# Altium project ProbadorManillaresCrio.PrjPcb
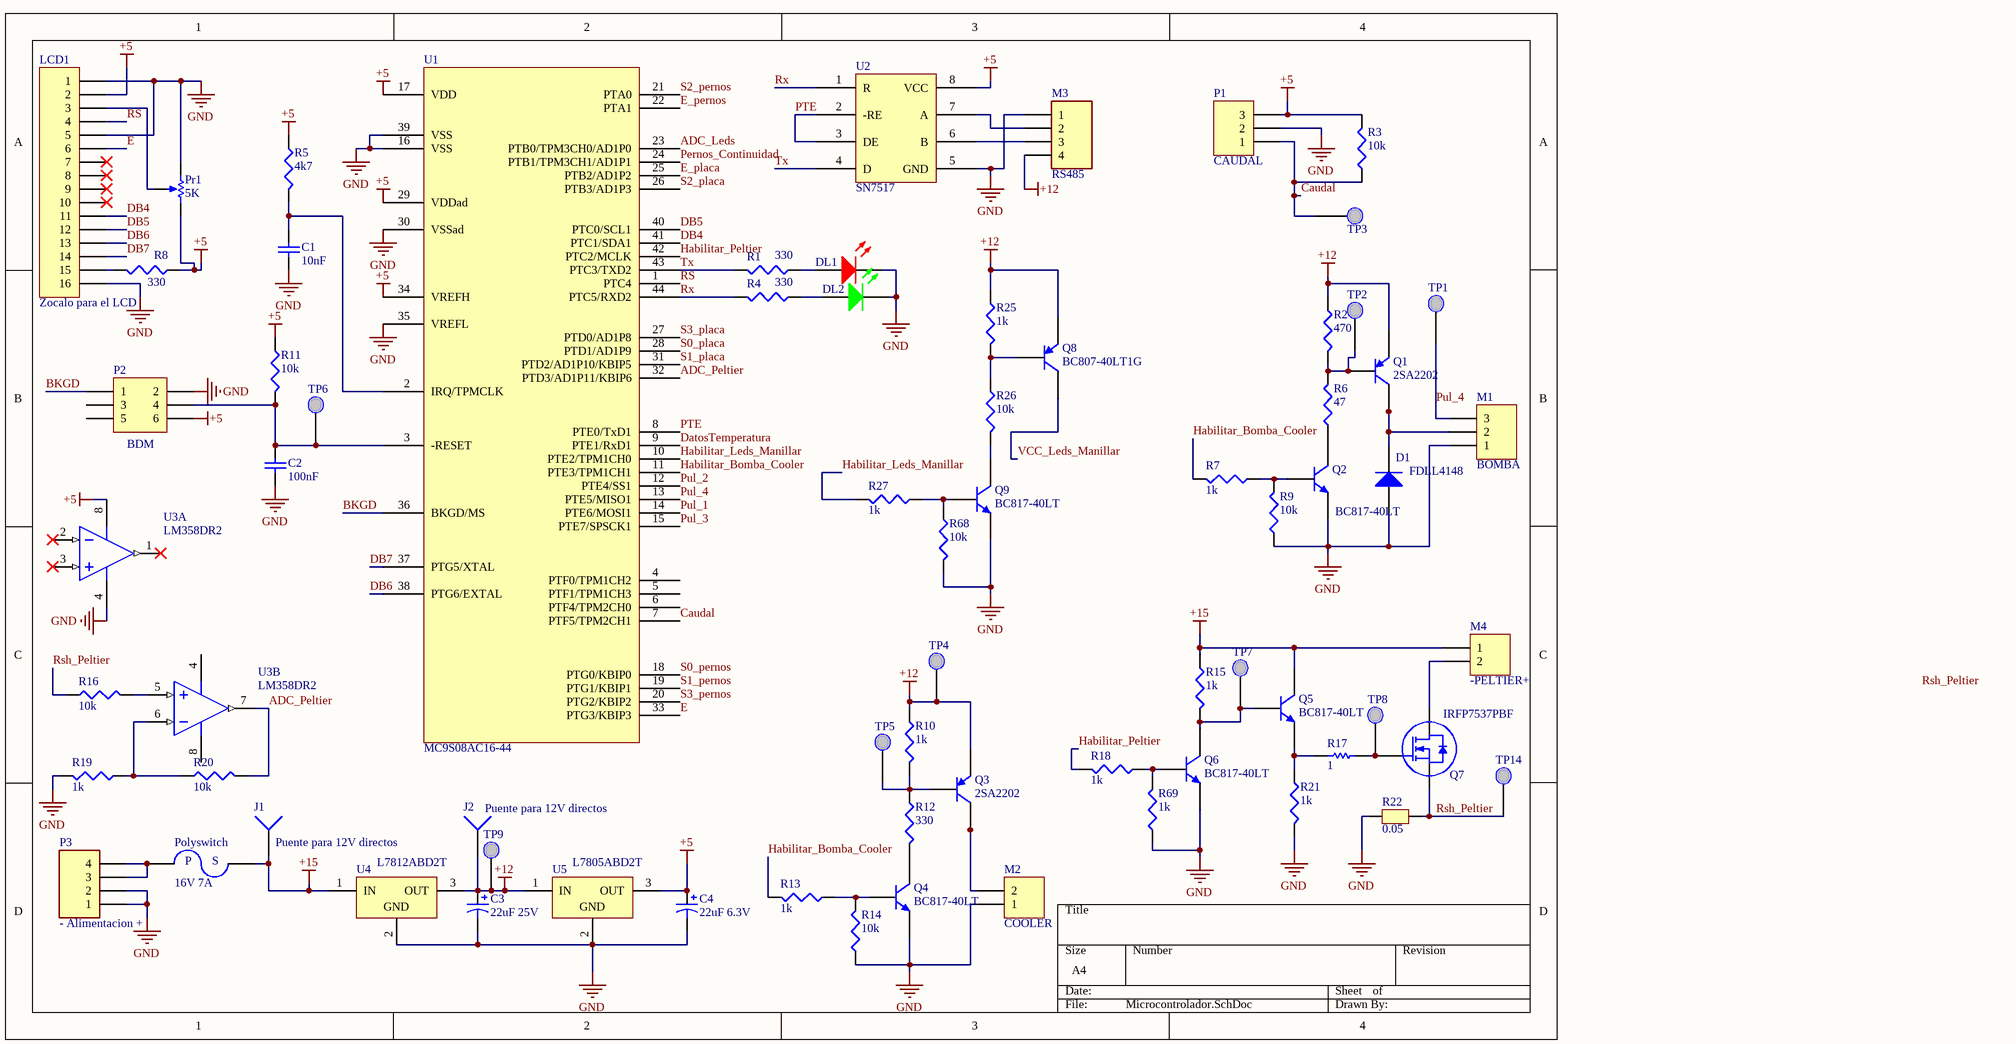
[diagram p0: Microcontrolador.SchDoc]
2 sheets, 144 parts. Net scope: global (net labels, ports and power ports of the same name join across sheets).
Board file: ProbadorManillaresCrio.PcbDoc
Sheets:
  Microcontrolador.SchDoc
  ProbadorManillaresCrio.SchDoc

## Sheet Microcontrolador.SchDoc
size A4

### Parts
C1  10nF  [6-0805_M]
C2  100nF  [6-0805_M]
C3  22uF 25V  [CAP100RP]
C4  22uF 6.3V  [CAP100RP]
D1  FDLL4148  [SOD-80/MLL34_3D]
DL1  Led3mmRojo  [LED-Rojo-3mm]  (value not drawn)
DL2  Led3mmVerde  [LED-Verde-3mm]  (value not drawn)
J1  Puente para 12V directos  [PIN1]
J2  Puente para 12V directos  [PIN1]
LCD1  Zocalo para el LCD  [LCD-20x4-Zocalo]
M1  BOMBA  [AMP100X3]
M2  COOLER  [640445-2_3D]
M3  RS485  [B4B-XH-A_3D]
M4  -PELTIER+  [640445-2_3D]
P1  CAUDAL  [B3B-XH-A_3D]
P2  BDM  [HDR2X3_3D]
P3  - Alimentacion +  [640445-4_3D]
Polyswitch  16V 7A  [Polyswitch 200mils]
Pr1  5K  [PRESET V]
Q1  2SA2202  [sot89_3D]
Q2  BC817-40LT  [SOT23_3D]
Q3  2SA2202  [sot89_3D]
Q4  BC817-40LT  [SOT23_3D]
Q5  BC817-40LT  [SOT23_3D]
Q6  BC817-40LT  [SOT23_3D]
Q7  IRFP7537PBF  [TO247]
Q8  BC807-40LT1G  [SOT23_3D]
Q9  BC817-40LT  [SOT23_3D]
R1  330  [6-0805_M]
R2  470  [6-0805_M]
R3  10k  [6-0805_M]
R4  330  [6-0805_M]
R5  4k7  [6-0805_M]
R6  47  [6-0805_M]
R7  1k  [6-0805_M]
R8  330  [6-0805_M]
R9  10k  [6-0805_M]
R10  1k  [6-0805_M]
R11  10k  [6-0805_M]
R12  330  [6-0805_M]
R13  1k  [6-0805_M]
R14  10k  [6-0805_M]
R15  1k  [6-0805_M]
R16  10k  [6-0805_M]
R17  1  [Res-Axial-0.4]
R18  1k  [6-0805_M]
R19  1k  [6-0805_M]
R20  10k  [6-0805_M]
R21  1k  [6-0805_M]
R22  0.05  [TO-220-Shunt]
R25  1k  [6-0805_M]
R26  10k  [6-0805_M]
R27  1k  [6-0805_M]
R68  10k  [6-0805_M]
R69  1k  [6-0805_M]
TP1  Test point  [TP-5002]  (value not drawn)
TP2  BaseQ1  [TP-5002]  (value not drawn)
TP3  Caudal  [TP-5002]  (value not drawn)
TP4  12v  [TP-5002]  (value not drawn)
TP5  BaseQ3  [TP-5002]  (value not drawn)
TP6  Reset  [TP-5002]  (value not drawn)
TP7  BaseQ5  [TP-5002]  (value not drawn)
TP8  GateQ7  [TP-5002]  (value not drawn)
TP9  12v  [TP-5002]  (value not drawn)
TP14  Vshunt  [TP-5002]  (value not drawn)
U1  MC9S08AC16-44  [QFP10x10-G44/Z14.4N_3D]
U2  SN7517  [751-07_N]
U3  LM358DR2  [751-07_L]  (parts A,B of 2)
U4  L7812ABD2T  [TO-263]
U5  L7805ABD2T  [TO-263]

### Nets
+5: C4.1 LCD1.2 P1.3 P2.6 Pr1.3(BOT_CW) R3.2 R5.1 R8.1 R11.1 U1.17(VDD) U1.29(VDDad) U1.34(VREFH) U2.8(VCC) U3.8(V+) U5.3(OUT)
+12: C3.1 J2.1 M3.4 Q1.3(E) Q3.3(E) Q8.2(E) R2.1 R10.1 R25.1 TP4.1 TP9.1 U4.3(OUT) U5.1(IN)
+15: J1.1 M4.1 Polyswitch.1 Q5.3(C) R15.1 U4.1(IN)
GND: C1.1 C2.1 C3.2 C4.2 D1.1(A) DL1.2(K) DL2.2(K) LCD1.1 LCD1.5 LCD1.16 M1.1 M2.1 M3.1 P1.2 P2.2 P3.1 P3.2 Pr1.1(TOP_CCW) Q2.2(E) Q4.2(E) Q6.2(E) Q9.2(E) R9.1 R14.1 R19.2 R21.2 R22.1 R68.2 R69.1 U1.16(VSS) U1.30(VSSad) U1.35(VREFL) U1.39(VSS) U2.5(GND) U3.4(V-) U4.2(GND) U5.2(GND)
ADC_Leds: U1.23(PTB0/TPM3CH0/AD1P0)
ADC_Peltier: R20.2 U1.32(PTD3/AD1P11/KBIP6) U3.7(OUT)
BKGD: P2.1 U1.36(BKGD/MS)
Caudal: P1.1 R3.1 TP3.1 U1.7(PTF5/TPM2CH1)
DatosTemperatura: U1.9(PTE1/RxD1)
DB4: LCD1.11 U1.41(PTC1/SDA1)
DB5: LCD1.12 U1.40(PTC0/SCL1)
DB6: LCD1.13 U1.38(PTG6/EXTAL)
DB7: LCD1.14 U1.37(PTG5/XTAL)
E: LCD1.6 U1.33(PTG3/KBIP3)
E_pernos: U1.22(PTA1)
E_placa: U1.25(PTB2/AD1P2)
Habilitar_Bomba_Cooler: R7.2 R13.2 U1.11(PTE3/TPM1CH1)
Habilitar_Leds_Manillar: R27.2 U1.10(PTE2/TPM1CH0)
Habilitar_Peltier: R18.2 U1.42(PTC2/MCLK)
Pernos_Continuidad: U1.24(PTB1/TPM3CH1/AD1P1)
PTE: U1.8(PTE0/TxD1) U2.2(-RE) U2.3(DE)
Pul_1: U1.14(PTE6/MOSI1)
Pul_2: U1.12(PTE4/SS1)
Pul_3: U1.15(PTE7/SPSCK1)
Pul_4: M1.3 TP1.1 U1.13(PTE5/MISO1)
RS: LCD1.4 U1.1(PTC4)
Rsh_Peltier: Q7.3(S) R16.1 R22.3 TP14.1
Rx: R4.2 U1.44(PTC5/RXD2) U2.1(R)
S0_pernos: U1.18(PTG0/KBIP0)
S0_placa: U1.28(PTD1/AD1P9)
S1_pernos: U1.19(PTG1/KBIP1)
S1_placa: U1.31(PTD2/AD1P10/KBIP5)
S2_pernos: U1.21(PTA0)
S2_placa: U1.26(PTB3/AD1P3)
S3_pernos: U1.20(PTG2/KBIP2)
S3_placa: U1.27(PTD0/AD1P8)
Tx: R1.2 U1.43(PTC3/TXD2) U2.4(D)
VCC_Leds_Manillar: Q8.3(C)
NetC1_2: C1.2 R5.2 U1.2(IRQ/TPMCLK)
NetC2_2: C2.2 P2.4 R11.2 TP6.1 U1.3(-RESET)
NetD1_2: D1.2(K) M1.2 Q1.0(C) Q1.2(C)
NetDL1_1: DL1.1(A) R1.1
NetDL2_1: DL2.1(A) R4.1
NetLCD1_3: LCD1.3 Pr1.2(TAP)
NetLCD1_15: LCD1.15 R8.2
NetM2_2: M2.2 Q3.0(C) Q3.2(C)
NetM3_2: M3.2 U2.7(A)
NetM3_3: M3.3 U2.6(B)
NetM4_2: M4.2 Q7.2(D)
NetP3_3: P3.3 P3.4 Polyswitch.2
NetQ1_1: Q1.1(B) R2.2 R6.2 TP2.1
NetQ2_1: Q2.1(B) R7.1 R9.2
NetQ2_3: Q2.3(C) R6.1
NetQ3_1: Q3.1(B) R10.2 R12.1 TP5.1
NetQ4_1: Q4.1(B) R13.1 R14.2
NetQ4_3: Q4.3(C) R12.2
NetQ5_1: Q5.1(B) Q6.3(C) R15.2 TP7.1
NetQ5_2: Q5.2(E) R17.2 R21.1
NetQ6_1: Q6.1(B) R18.1 R69.2
NetQ7_1: Q7.1(G) R17.1 TP8.1
NetQ8_1: Q8.1(B) R25.2 R26.1
NetQ9_1: Q9.1(B) R27.1 R68.1
NetQ9_3: Q9.3(C) R26.2
NetR16_2: R16.2 U3.5(IN+)
NetR19_1: R19.1 R20.1 U3.6(IN-)

Not connected (* = marked no-connect by the designer): LCD1 7* 8* 9* 10*; P2 3 5; U1 4(PTF0/TPM1CH2) 5(PTF1/TPM1CH3) 6(PTF4/TPM2CH0); U3 1(OUT)* 2(IN-)* 3(IN+)*

### Notes on the sheet
- Labels drawn without touching a wire or pin: Rsh_Peltier
- (in symbol Polyswitch) P; S

### Library data of the parts
C1 = Cap: CAP CER 10000PF 50V 10% X7R 0805; Cod.Fabricante: C0805C103K5RACTU; Fabricante: Kemet; PackageReference: 6-0805_M; PackageDescription: Radial Cap, Thru-Hole; 2 Leads; 0.3 in Pin Spacing; Value: 10nF; Cod.Digikey: 399-1158-1-ND; DIGIKEYx100: 0.06190
C2 = Cap: CAP CER 0.1UF 50V 10% X7R 0805; Cod.Fabricante: C0805C104K5RACTU; Fabricante: Kemet; PackageReference: 6-0805_M; PackageDescription: Radial Cap, Thru-Hole; 2 Leads; 0.3 in Pin Spacing; Value: 100nF; Cod.Digikey: 399-1170-1-ND; DIGIKEYx100: 0.08340
C3 = CAP_ALUM_22UF_25V: CAP ALUM 22UF 20% 25V RADIAL; Cod.Fabricante: UVR1E220MDD; Fabricante: Nichicon; Published: 8-Jun-2000; LatestRevisionDate: 17-Jul-2002; LatestRevisionNote: Re-released for DXP Platform.; Publisher: Altium Limited; PackageDescription: Radial, Can; Value: 22uF 25V; Cod.Digikey: 493-1058-ND; DIGIKEYx100: 0.08420; ComponentLink2URL: http://nichicon-us.com/english/products/pdfs/e-uvr.pdf; ComponentLink2Description: Datasheet
C4 = CAP_ALUM_22UF_6.3V: CAP ALUM 22UF 20% 6.3V RADIAL; Cod.Fabricante: UVR0J220MDD1TD; Fabricante: Nichicon; Published: 8-Jun-2000; LatestRevisionDate: 17-Jul-2002; LatestRevisionNote: Re-released for DXP Platform.; Publisher: Altium Limited; PackageDescription: Radial, Can; Value: 22uF 6.3V; Cod.Digikey: 493-12740-1-ND; DIGIKEYx100: 0.09520; ComponentLink2URL: http://nichicon-us.com/english/products/pdfs/e-uvr.pdf; ComponentLink2Description: Datasheet
D1 = Diode FDLL4148: DIODE GEN PURP 100V 200MA LL34/SOD80/MINI MELF; Fabricante: ON Semiconductor; Published: 8-Jun-2000; LatestRevisionDate: 17-Jul-2002; LatestRevisionNote: Re-released for DXP Platform.; DatasheetDocument: 1998; PackageDocument: Aug-1999; PackageReference: MINI MELF; Publisher: Altium Limited; Code_JEDEC: MINI MELF; ComponentLink1Description: Manufacturer Link; ComponentLink1URL: https://www.fairchildsemi.com; ComponentLink2Description: Datasheet; ComponentLink2URL: https://www.fairchildsemi.com/datasheets/FD/FDLL4148.pdf; Value: FDLL4148; Cod.Digikey: FDLL4148CT-ND; Cod.Fabricante: FDLL4148; DIGIKEYx100: 0.0487
DL1 = Led3mmRojo: LED RED DIFFUSED 3MM ROUND T/H; Cod.Fabricante: 151031SS04000; Fabricante: Wurth Electronics Inc.; Cod.DigiKey: 732-5005-ND; ComponentLink1Description: Manufacturer Link; ComponentLink1URL: *; ComponentLink2Description: Datasheet; ComponentLink2URL: https://katalog.we-online.de/led/datasheet/151031SS04000.pdf; DatasheetVersion: *; DIGIKEYx100: 0.14480; LatestRevisionDate: *; LatestRevisionNote: *; PackageDescription: *; PackageReference: *; PackageVersion: *; Published: 29-sep-00; Publisher: Altium Limited; Value: *
DL2 = Led3mmVerde: LED GREEN DIFFUSED 3MM ROUND T/H; Cod.Fabricante: 151031VS06000; Fabricante: Wurth Electronics Inc.; Cod.DigiKey: 732-5008-ND; ComponentLink1Description: Manufacturer Link; ComponentLink1URL: *; ComponentLink2Description: Datasheet; ComponentLink2URL: https://katalog.we-online.de/led/datasheet/151031VS06000.pdf; DatasheetVersion: *; DIGIKEYx100: 0.13070; LatestRevisionDate: *; LatestRevisionNote: *; PackageDescription: *; PackageReference: *; PackageVersion: *; Published: 29-sep-00; Publisher: Altium Limited; Value: *
J1 J2 = Socket: Value: Via simple; LatestRevisionDate: 17-Jul-2002; LatestRevisionNote: Re-released for DXP Platform.; Publisher: Altium Limited; Cod.Digikey: -; Cod.Fabricante: -; Fabricante: -
LCD1 = Header 16: LCD de 20x4; Cod.Fabricante: PPPC161LFBN-RC; Fabricante: Sullins Connector Solutions; LatestRevisionDate: 17-Jul-2002; LatestRevisionNote: Re-released for DXP Platform.; Publisher: Altium Limited; Cod.Digikey: S7049-ND; ComponentLink1Description: Datasheets; ComponentLink1URL: https://drawings-pdf.s3.amazonaws.com/10492.pdf; ComponentLink2Description: Datasheets; ComponentLink2URL: https://media.digikey.com/pdf/Data%20Sheets/Sullins%20PDFs/Female_Headers.100_DS.pdf; DatasheetVersion: *; DIGIKEYx100: 0.77420
M1 = Header 3: CONN HEADER VERT 3POS .100 TIN; Cod.Fabricante: 640456-3; Fabricante: TE Connectivity AMP Connectors; LatestRevisionDate: 17-Jul-2002; LatestRevisionNote: Re-released for DXP Platform.; Publisher: Altium Limited; Cod.Digikey: A19470-ND; DIGIKEYx100: 0.09240
M2 M4 = 640445-2: CONN HEADER VERT 2POS .156 TIN; Fabricante: TE Connectivity AMP Connectors; LatestRevisionDate: 17-Jul-2002; LatestRevisionNote: Re-released for DXP Platform.; Publisher: Altium Limited; Cod.Digikey: A1971-ND; Cod.Fabricante: 640445-2; Value: 640445-2
  M2: DIGIKEYx100: 0.08110
M3 = JST_2.5_4: CONN HEADER XH TOP 4POS 2.5MM; Cod.Fabricante: B4B-XH-A(LF)(SN); Fabricante: JST Sales America Inc.; LatestRevisionDate: 17-Jul-2002; LatestRevisionNote: Re-released for DXP Platform.; Publisher: Altium Limited; Cod.Digikey: 455-2249-ND; ComponentLink2Description: Datasheet; ComponentLink2URL: http://www.jst-mfg.com/product/pdf/eng/eXH.pdf; DIGIKEYx100: 0.1348
P1 = JST_2.5_3_1: CONN HEADER XH TOP 3POS 2.5MM; Cod.Fabricante: B3B-XH-A(LF)(SN); Fabricante: JST Sales America Inc.; LatestRevisionDate: 17-Jul-2002; LatestRevisionNote: Re-released for DXP Platform.; Publisher: Altium Limited; Cod.Digikey: 455-2248-ND; ComponentLink2Description: Datasheet; ComponentLink2URL: http://www.jst-mfg.com/product/pdf/eng/eXH.pdf; DIGIKEYx100: 0.1115
P2 = Header 3X2: DIL VERTICAL PC TAIL PIN HEADER; Value: M20-9980345; Fabricante: Harwin Inc; PackageReference: HDR2X3; PackageDescription: Macho .1"x.1" 6 Recto; Cod.Digikey: 952-2120-ND; Cod.Fabricante: M20-9980345
P3 = JST_2.5_4: CONN HEADER VERT 4POS .156 TIN; Cod.Fabricante: 640445-4; Fabricante: TE Connectivity AMP Connectors; LatestRevisionDate: 17-Jul-2002; LatestRevisionNote: Re-released for DXP Platform.; Publisher: Altium Limited; Cod.Digikey: A1972-ND; ComponentLink2Description: Datasheet; ComponentLink2URL: https://www.te.com/commerce/DocumentDelivery/DDEController?Action=srchrtrv&DocNm=640445&DocType=Customer+Drawing&DocLang=English; DIGIKEYx100: 0.19700
Polyswitch = Polyswitch: PTC RESET FUSE 16V 7A RADIAL; Cod.Fabricante: RGEF700; Fabricante: Littelfuse Inc.; Cod.Digikey: RGEF700HF-ND; ComponentLink1Description: Manufacturer Link; ComponentLink1URL: *; ComponentLink2Description: Datasheet; ComponentLink2URL: http://www.littelfuse.com/~/media/electronics/product_specifications/resettable_ptcs/littelfuse_ptc_rgef700_product_specification.pdf.pdf; DatasheetVersion: *; DIGIKEYx100: 0.45320; LatestRevisionDate: *; LatestRevisionNote: *; PackageDescription: *; PackageReference: *; PackageVersion: *; Published: *; Publisher: *; Value: 16V 7A
Pr1 = Preset_Multi_Vert_3D: TRIMMER 5K OHM 0.5W PC PIN; Sim Note: Enter the Resistance value and the set point into parameter fields.; Set Position: 0.5; Cod.Fabricante: 3296W-1-502LF; Fabricante: Bourns Inc.; Published: 8-Jun-2000; LatestRevisionDate: 17-Jul-2002; LatestRevisionNote: Re-released for DXP Platform.; PackageReference: VR5; Publisher: Altium Limited; PackageDescription: Variable Resistor, Thru-Hole; 3 Leads; Series: 3296W; Cod.Digikey: 3296W-502LF-ND; DIGIKEYx100: 1.752; Value: 5K
Q1 Q3 = 2SA2202: TRANS PNP 100V 2A SOT89-3; Cod.Fabricante: 2SA2202-TD-E; Fabricante: ON Semiconductor; Published: 29-Sep-2000; LatestRevisionDate: 17-Jul-2002; LatestRevisionNote: Re-released for DXP Platform.; DatasheetVersion: 1996; PackageVersion: 1996; PackageReference: SOT89; Publisher: Altium Limited; PackageDescription: Package SOT89-3, Lead Pitch 1.5mm, Body Size 4.6x2.6mm (4.6x4.2mm with pins); ComponentLink1Description: Manufacturer Link; ComponentLink1URL: http://www.onsemi.com/site/products/landing?taxonomyID=194; ComponentLink2Description: Datasheet; ComponentLink2URL: http://www.onsemi.com/pub/Collateral/2SA2202-D.PDF; Value: 2SA2202; Cod.Digikey: 2SA2202-TD-EOSCT-ND; DIGIKEYx100: 0.2925
Q2 Q4-Q6 Q9 = BC817: TRANS NPN 45V 0.5A SOT23; Cod.Fabricante: BC817-40LT1G; Fabricante: ON Semiconductor; Published: 8-Jun-2000; PackageReference: SOT-23-3; Publisher: Altium Limited; ComponentLink1Description: Manufacturer Link; ComponentLink1URL: http://www.onsemi.com/; ComponentLink2Description: Datasheet; ComponentLink2URL: http://www.onsemi.com/pub/Collateral/BC817-16LT1-D.PDF; Cod.Digikey: BC817-40LT1GOSCT-ND; PackageDescription: TO, Flat Index; 3 In-Line, Axial Leads; Body Dia. 4.5mm; Leads 0.51 x 0.48 mm (max); Value: BC817-40LT; DIGIKEYx100: 0.08810; LatestRevisionDate: 15-Jan-2003; LatestRevisionNote: PCB Footprint 'BCY-W3/D4.7' replaced; DatasheetVersion: 1997; PackageVersion: Sep-1998
Q7 = MOSFET N: MOSFET N CH 60V 172A TO247; Fabricante: Infineon Technologies Americas Corp.; Value: IRFP7537PBF; Cod.Digikey: IRFP7537PBF-ND; Cod.Fabricante: IRFP7537PBF
Q8 = BC807: TRANS PNP 45V 0.5A SOT23; Fabricante: ON Semiconductor; Published: 29-Sep-2000; LatestRevisionDate: 17-Jul-2002; LatestRevisionNote: Re-released for DXP Platform.; DatasheetVersion: 1996; PackageVersion: 1996; PackageReference: SOT23-3; Publisher: Altium Limited; ComponentLink1Description: Manufacturer Link; ComponentLink1URL: http://www.onsemi.com/site/products/landing?taxonomyID=194; ComponentLink2Description: Datasheet; ComponentLink2URL: http://www.onsemi.com/pub/Collateral/2SA2202-D.PDF; Value: BC807-40LT1G; Cod.Digikey: BC807-40LT1GOSCT-ND; Cod.Fabricante: BC807-40LT1G; DIGIKEYx100: 0.0626
R1 R4 R8 R12 = Res3: RES SMD 330 OHM 1% 1/8W 0805; Cod.Fabricante: RC0805FR-07330RL; Fabricante: Yageo; PackageReference: 6-0805_M; PackageDescription: Chip Resistor; Value: 330; Cod.Digikey: 311-330CRCT-ND; ComponentLink1Description: Manufacturer Link; ComponentLink1URL: http://www.yageo.com/documents/recent/PYu-RC_Group_51_RoHS_L_10.pdf; ComponentLink2Description: Datasheet; ComponentLink2URL: http://www.yageo.com/exep/pages/download/literatures/PYu-R_Marking_2.pdf; DatasheetVersion: 1996; DIGIKEYx100: 0.017; LatestRevisionDate: 17-jul-02; LatestRevisionNote: Re-released for DXP Platform.; PackageVersion: *; Published: *; Publisher: *
R2 = Res3: RES SMD 470 OHM 1% 1/8W 0805; Cod.Fabricante: RC0805FR-07470RL; Fabricante: Yageo; PackageReference: 6-0805_M; PackageDescription: Chip Resistor; Value: 470; Cod.Digikey: 311-470CRCT-ND; ComponentLink1Description: Manufacturer Link; ComponentLink1URL: http://www.yageo.com/documents/recent/PYu-RC_Group_51_RoHS_L_10.pdf; ComponentLink2Description: Datasheet; ComponentLink2URL: http://www.yageo.com/exep/pages/download/literatures/PYu-R_Marking_2.pdf; DatasheetVersion: 1996; DIGIKEYx100: 0.017; LatestRevisionDate: 17-jul-02; LatestRevisionNote: Re-released for DXP Platform.; PackageVersion: *; Published: *; Publisher: *
R3 R9 R11 R14 R16 R20 R26 R68 = Res3: RES SMD 10K OHM 1% 1/8W 0805; Cod.Fabricante: RC0805FR-0710KL; Fabricante: Yageo; PackageReference: 6-0805_M; PackageDescription: Chip Resistor; Value: 10k; Cod.Digikey: 311-10.0KCRCT-ND; ComponentLink1Description: Manufacturer Link; ComponentLink1URL: http://www.yageo.com/documents/recent/PYu-RC_Group_51_RoHS_L_10.pdf; ComponentLink2Description: Datasheet; ComponentLink2URL: http://www.yageo.com/exep/pages/download/literatures/PYu-R_Marking_2.pdf; DatasheetVersion: 1996; DIGIKEYx100: 0.017; LatestRevisionDate: 17-jul-02; LatestRevisionNote: Re-released for DXP Platform.; PackageVersion: *; Published: *; Publisher: *
R5 = Res3: RES SMD 4K7 OHM 1% 1/8W 0805; Cod.Fabricante: RC0805FR-074K7L; Fabricante: Yageo; PackageReference: 6-0805_M; PackageDescription: Chip Resistor; Value: 4k7; Cod.Digikey: 311-4.70KCRCT-ND; ComponentLink1Description: Manufacturer Link; ComponentLink1URL: http://www.yageo.com/documents/recent/PYu-RC_Group_51_RoHS_L_10.pdf; ComponentLink2Description: Datasheet; ComponentLink2URL: http://www.yageo.com/exep/pages/download/literatures/PYu-R_Marking_2.pdf; DatasheetVersion: 1996; DIGIKEYx100: 0.017; LatestRevisionDate: 17-jul-02; LatestRevisionNote: Re-released for DXP Platform.; PackageVersion: *; Published: *; Publisher: *
R6 = Res3: RES SMD 47 OHM 5% 1/2W 0805; Cod.Fabricante: ERJ-P06J470V; Fabricante: Panasonic Electronic Components; PackageReference: 6-0805_M; PackageDescription: Chip Resistor; Value: 47; Cod.Digikey: P47ADCT-ND; ComponentLink1Description: Manufacturer Link; ComponentLink1URL: https://industrial.panasonic.com/cdbs/www-data/pdf/RDO0000/AOA0000C331.pdf; ComponentLink2Description: Datasheet; ComponentLink2URL: https://industrial.panasonic.com/ww/system/files/data/download/catalog/id_fixed-resistors_e_1.pdf; DatasheetVersion: 1996; DIGIKEYx100: 0.04470; LatestRevisionDate: 17-jul-02; LatestRevisionNote: Re-released for DXP Platform.; PackageVersion: *; Published: *; Publisher: *
R7 R10 R13 R15 R18 R19 R21 R25 R27 R69 = Res3: RES SMD 1K OHM 1% 1/8W 0805; Cod.Fabricante: RC0805FR-071KL; Fabricante: Yageo; PackageReference: 6-0805_M; PackageDescription: Chip Resistor; Value: 1k; Cod.Digikey: 311-1.00KCRCT-ND; ComponentLink1Description: Manufacturer Link; ComponentLink1URL: http://www.yageo.com/documents/recent/PYu-RC_Group_51_RoHS_L_10.pdf; ComponentLink2Description: Datasheet; ComponentLink2URL: http://www.yageo.com/exep/pages/download/literatures/PYu-R_Marking_2.pdf; DatasheetVersion: 1996; DIGIKEYx100: 0.017; LatestRevisionDate: 17-jul-02; LatestRevisionNote: Re-released for DXP Platform.; PackageVersion: *; Published: *; Publisher: *
R17 = Resistor-0.25W: Resistencia axial de 0.25W y 400 mils; Cod.Fabricante: CF14JT1R00; Fabricante: Stackpole Electronics Inc.; Published: 8-Jun-2000; LatestRevisionDate: 17-Jul-2002; LatestRevisionNote: Re-released for DXP Platform.; PackageReference: AXIAL-0.4; Publisher: Altium Limited; PackageDescription: Axial Device, Thru-Hole; 2 Leads; 0.3 in Pin Spacing; Value: 1; Cod.Digikey: CF14JT1R00CT-ND; ComponentLink1Description: Datasheet; ComponentLink1URL: https://www.seielect.com/Catalog/SEI-CF_CFM.pdf; ComponentLink2Description: Packaging specs; ComponentLink2URL: https://www.seielect.com/catalog/SEI-Packaging.pdf; DatasheetVersion: *; DIGIKEYx100: 0.01680; PackageVersion: *
R22 = Shunt-0.05Ohms: 50 mOhms ±5% 35W Through Hole Resistor TO-220-2 Current Sense Thin Film; Cod.Fabricante: PF2203-0R05J1; Fabricante: Riedon; Published: 8-Jun-2000; LatestRevisionDate: 17-Jul-2002; LatestRevisionNote: Re-released for DXP Platform.; PackageReference: TO220; Publisher: Altium Limited; PackageDescription: Axial Device, Thru-Hole; 2 Leads; 0.3 in Pin Spacing; Value: 0.05; Cod.Digikey: 696-1160-ND; ComponentLink1Description: Datasheet; ComponentLink1URL: https://riedon.com/media/pdf/PF2200.pdf; ComponentLink2Description: Packaging specs; ComponentLink2URL: *; DatasheetVersion: *; DIGIKEYx100: 2.03770; PackageVersion: *
TP1-TP9 TP14 = TestPoint: White PC Test Point, Miniature Phosphor Bronze, Silver Plating 0.040" (1.02mm) Hole Diameter Mounting Type; Cod.Fabricante: 5002; Fabricante: Keystone Electronics; Cod.DigiKey: 36-5002-ND; ComponentLink1Description: Manufacturer Link; ComponentLink1URL: http://www.keyelco.com/product-pdf.cfm?p=1311; ComponentLink2Description: Datasheet; ComponentLink2URL: *; DatasheetVersion: *; DIGIKEYx100: 0.22090; LatestRevisionDate: *; LatestRevisionNote: *; PackageDescription: *; PackageReference: *; PackageVersion: *; Published: 29-sep-00; Publisher: Altium Limited; Value: Test point
U1 = SMD-MC9S08AC16-44: S08 S08 Microcontroller IC 8-Bit 40MHz 16KB (16K x 8) FLASH 32-LQFP (7x7); Cod.Fabricante: MC9S08AC16CFGE; Fabricante: NXP; Cod.Digikey: MC9S08AC16CFGE-ND; ComponentLink1Description: Manufacturer Link; ComponentLink1URL: https://www.nxp.com/docs/en/data-sheet/MC9S08AC16.pdf; ComponentLink2Description: Datasheet; ComponentLink2URL: https://www.nxp.com/docs/en/data-sheet/MC9S08AC16.pdf; DatasheetVersion: Rev. 9; DIGIKEYx100: 4.1535; LatestRevisionDate: 8/2011; LatestRevisionNote: *; PackageDescription: *; PackageReference: *; PackageVersion: 44-LQFP; Published: *; Publisher: *; Value: MC9S08AC16-44
U2 = SN7517: IC TXRX DIFF BUSS 8SOIC; Cod.Fabricante: SN75176BDR; Fabricante: Texas Instruments; ComponentLink1Description: Manufacturer Link; ComponentLink1URL: http://www.ti.com/general/docs/suppproductinfo.tsp?distId=10&gotoUrl=http%3A%2F%2Fwww.ti.com%2Flit%2Fgpn%2Fsn65176b; ComponentLink2Description: Datasheet; ComponentLink2URL: http://www.ti.com/general/docs/suppproductinfo.tsp?distId=10&gotoUrl=http%3A%2F%2Fwww.ti.com%2Flit%2Fgpn%2Fsn65176b; DatasheetVersion: 1996; DIGIKEYx100: 1.55330; LatestRevisionDate: 17-jul-02; LatestRevisionNote: Re-released for DXP Platform.; PackageDescription: 8-SOIC; PackageReference: 8-SOIC; PackageVersion: 1996; Published: 29-sep-00; Publisher: Altium Limited; Value: SN7517; Cod.Digikey: 296-1275-1-ND
U3 = LM358DR2: Single-Supply Dual Operational Amplifier; Fabricante: ON Semiconductor; Cod.Fabricante: LM358DR2G; Value: LM358; Published: 28-Feb-2003; LatestRevisionDate: 13-Apr-2006; LatestRevisionNote: IPC-7351 Footprint Added.; DatasheetVersion: Jan-2002, Rev. 7; PackageVersion: rev7, Jan-2002; PackageReference: 751-07; Publisher: Altium Limited; PackageDescription: 8-Pin Plastic Small Outline Integrated Circuit 1.27 mm Pitch; ComponentLink1Description: Manufacturer Link; ComponentLink1URL: http://www.onsemi.com/; ComponentLink2Description: Datasheet; ComponentLink2URL: http://www.onsemi.com/pub/Collateral/LM358-D.PDF; Cod.Digikey: LM358DR2GOSCT-ND
U4 = L7805ABD2T: IC REG LINEAR 12V 1.5A D2PAK; Cod.Fabricante: L7812ABD2T-TR; Fabricante: STMicroelectronics; Published: 24-Aug-2001; LatestRevisionDate: 17-Jul-2002; LatestRevisionNote: Re-released for DXP Platform.; DatasheetVersion: Nov-1999; PackageReference: TO-263; Publisher: Altium Limited; PackageDescription: D2-PAK/TO-263-AB; 3 Leads (1 Cropped); Body 15.9 (inc. leads) x 10.4 mm (LxW max); ComponentLink1Description: Manufacturer Link; ComponentLink1URL: http://www.st.com/; ComponentLink2Description: Datasheet; ComponentLink2URL: http://www.st.com/content/ccc/resource/technical/document/datasheet/41/4f/b3/b0/12/d4/47/88/CD00000444.pdf/files/CD00000444.pdf/jcr:content/translations/en.CD00000444.pdf; Cod.Digikey: 497-6037-1-ND; DIGIKEYx100: 0.52380; Value: L7812ABD2T
U5 = L7805ABD2T: IC REG LINEAR 5V 1.5A D2PAK; Cod.Fabricante: L7805ABD2T-TR; Fabricante: STMicroelectronics; Published: 24-Aug-2001; LatestRevisionDate: 17-Jul-2002; LatestRevisionNote: Re-released for DXP Platform.; DatasheetVersion: Nov-1999; PackageReference: TO-263; Publisher: Altium Limited; PackageDescription: D2-PAK/TO-263-AB; 3 Leads (1 Cropped); Body 15.9 (inc. leads) x 10.4 mm (LxW max); ComponentLink1Description: Manufacturer Link; ComponentLink1URL: http://www.st.com/; ComponentLink2Description: Datasheet; ComponentLink2URL: http://www.st.com/content/ccc/resource/technical/document/datasheet/41/4f/b3/b0/12/d4/47/88/CD00000444.pdf/files/CD00000444.pdf/jcr:content/translations/en.CD00000444.pdf; Cod.Digikey: 497-1170-1-ND; DIGIKEYx100: 0.52460; Value: L7805ABD2T

## Sheet ProbadorManillaresCrio.SchDoc
size A3
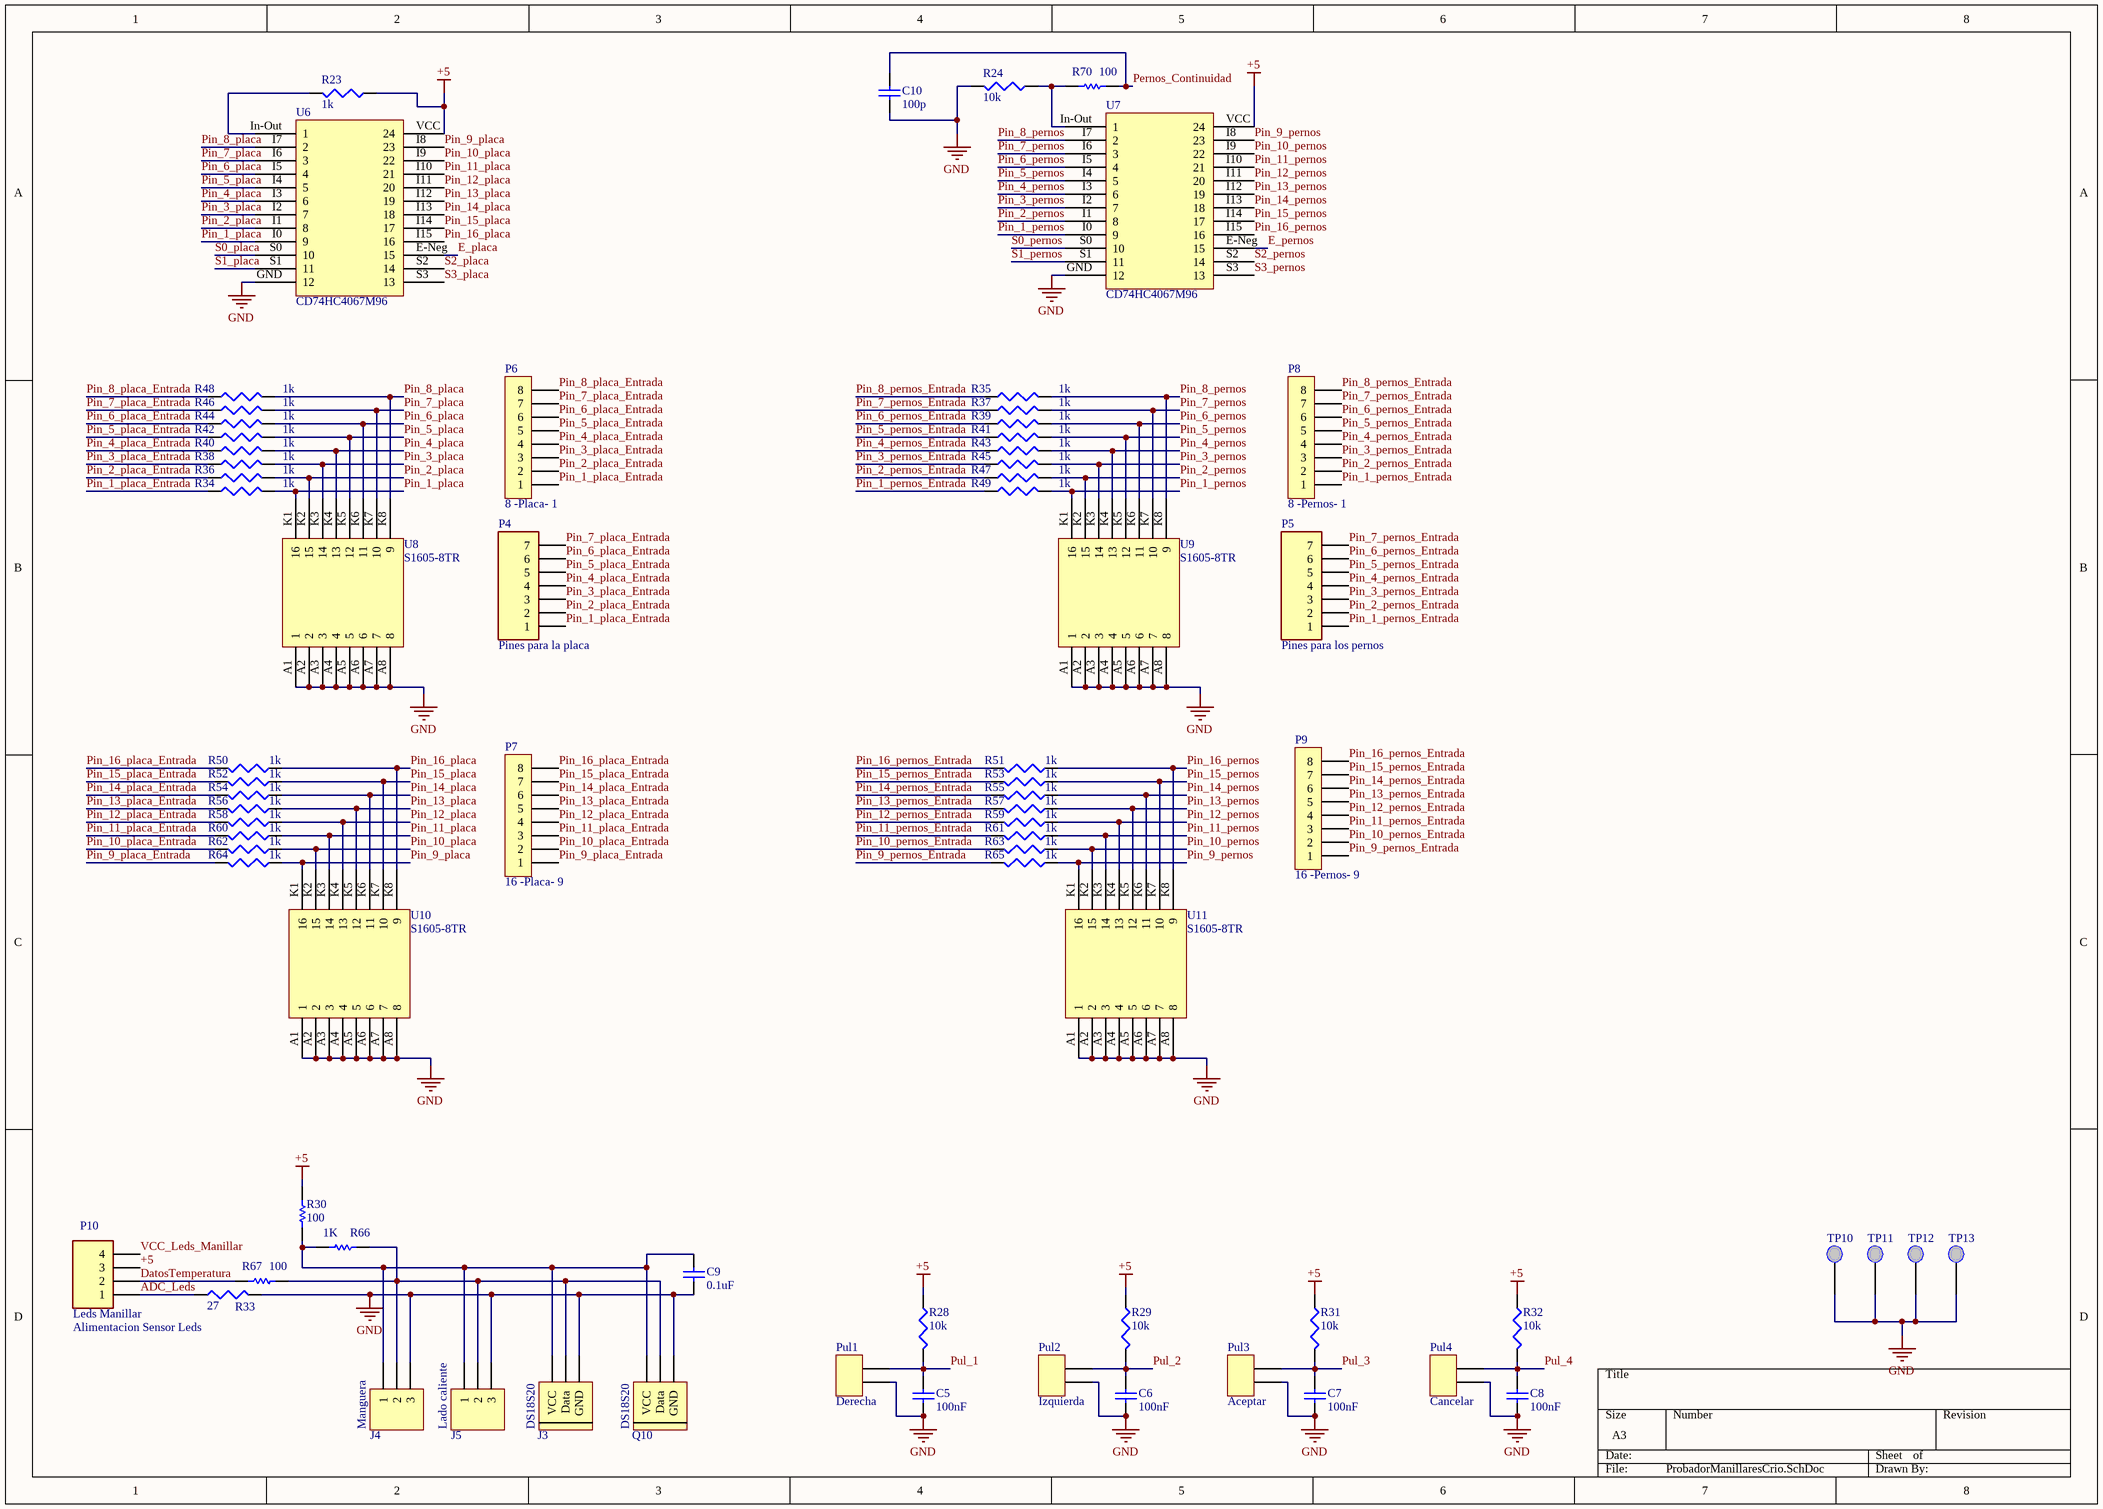
[diagram p1: ProbadorManillaresCrio.SchDoc]

### Parts
C5  100nF  [6-0805_M]
C6  100nF  [6-0805_M]
C7  100nF  [6-0805_M]
C8  100nF  [6-0805_M]
C9  0.1uF  [C_0805_3D]
C10  100p  [C_0805_3D]
J3  DS18S20  [DS18S20-ZocaloDirecto]
J4  Manguera  [B3B-XH-A_3D]
J5  Lado caliente  [B3B-XH-A_3D]
P4  Pines para la placa  [B7B-XH-A_3D]
P5  Pines para los pernos  [B7B-XH-A_3D]
P6  8 -Placa- 1  [PinesMacho8]
P7  16 -Placa- 9  [PinesMacho8]
P8  8 -Pernos- 1  [PinesMacho8]
P9  16 -Pernos- 9  [PinesMacho8]
P10  Leds Manillar  Funcion: Alimentacion Sensor Leds  [B4B-XH-A_3D]
Pul1  Derecha  [Jumper-Simple]
Pul2  Izquierda  [Jumper-Simple]
Pul3  Aceptar  [Jumper-Simple]
Pul4  Cancelar  [Jumper-Simple]
Q10  DS18S20  [TO92_123]
R23  1k  [6-0805_M]
R24  10k  [6-0805_M]
R28  10k  [6-0805_M]
R29  10k  [6-0805_M]
R30  100  [R_0805_3D]
R31  10k  [6-0805_M]
R32  10k  [6-0805_M]
R33  27  [6-0805_M]
R34  1k  [6-0805_M]
R35  1k  [6-0805_M]
R36  1k  [6-0805_M]
R37  1k  [6-0805_M]
R38  1k  [6-0805_M]
R39  1k  [6-0805_M]
R40  1k  [6-0805_M]
R41  1k  [6-0805_M]
R42  1k  [6-0805_M]
R43  1k  [6-0805_M]
R44  1k  [6-0805_M]
R45  1k  [6-0805_M]
R46  1k  [6-0805_M]
R47  1k  [6-0805_M]
R48  1k  [6-0805_M]
R49  1k  [6-0805_M]
R50  1k  [6-0805_M]
R51  1k  [6-0805_M]
R52  1k  [6-0805_M]
R53  1k  [6-0805_M]
R54  1k  [6-0805_M]
R55  1k  [6-0805_M]
R56  1k  [6-0805_M]
R57  1k  [6-0805_M]
R58  1k  [6-0805_M]
R59  1k  [6-0805_M]
R60  1k  [6-0805_M]
R61  1k  [6-0805_M]
R62  1k  [6-0805_M]
R63  1k  [6-0805_M]
R64  1k  [6-0805_M]
R65  1k  [6-0805_M]
R66  1K  [R_0805_3D]
R67  100  [R_0805_3D]
R70  100  [R_0805_3D]
TP10  GND  [TP-5002]  (value not drawn)
TP11  GND  [TP-5002]  (value not drawn)
TP12  GND  [TP-5002]  (value not drawn)
TP13  GND  [TP-5002]  (value not drawn)
U6  CD74HC4067M96  [SOIC24]
U7  CD74HC4067M96  [SOIC24]
U8  S1605-8TR  [SO16]
U9  S1605-8TR  [SO16]
U10  S1605-8TR  [SO16]
U11  S1605-8TR  [SO16]

### Nets
+5: P10.3 R23.1 R28.1 R29.1 R30.2 R31.1 R32.1 U6.VCC(24) U7.VCC(24)
GND: C5.1 C6.1 C7.1 C8.1 C9.1 C10.2 J3.1(GND) J4.3 J5.3 Pul1.2 Pul2.2 Pul3.2 Pul4.2 Q10.1(GND) R24.2 R33.2 TP10.1 TP11.1 TP12.1 TP13.1 U6.GND(12) U7.GND(12) U8.A1(1) U8.A2(2) U8.A3(3) U8.A4(4) U8.A5(5) U8.A6(6) U8.A7(7) U8.A8(8) U9.A1(1) U9.A2(2) U9.A3(3) U9.A4(4) U9.A5(5) U9.A6(6) U9.A7(7) U9.A8(8) U10.A1(1) U10.A2(2) U10.A3(3) U10.A4(4) U10.A5(5) U10.A6(6) U10.A7(7) U10.A8(8) U11.A1(1) U11.A2(2) U11.A3(3) U11.A4(4) U11.A5(5) U11.A6(6) U11.A7(7) U11.A8(8)
ADC_Leds: P10.1 R33.1
DatosTemperatura: P10.2 R67.1
E_pernos: U7.E-Neg(15)
E_placa: U6.E-Neg(15)
Pernos_Continuidad: C10.1 R70.2
Pin_1_pernos: R49.2 U7.I0(9) U9.K1(16)
Pin_1_pernos_Entrada: P5.1 P8.1 R49.1
Pin_1_placa: R34.2 U6.I0(9) U8.K1(16)
Pin_1_placa_Entrada: P4.1 P6.1 R34.1
Pin_2_pernos: R47.2 U7.I1(8) U9.K2(15)
Pin_2_pernos_Entrada: P5.2 P8.2 R47.1
Pin_2_placa: R36.2 U6.I1(8) U8.K2(15)
Pin_2_placa_Entrada: P4.2 P6.2 R36.1
Pin_3_pernos: R45.2 U7.I2(7) U9.K3(14)
Pin_3_pernos_Entrada: P5.3 P8.3 R45.1
Pin_3_placa: R38.2 U6.I2(7) U8.K3(14)
Pin_3_placa_Entrada: P4.3 P6.3 R38.1
Pin_4_pernos: R43.2 U7.I3(6) U9.K4(13)
Pin_4_pernos_Entrada: P5.4 P8.4 R43.1
Pin_4_placa: R40.2 U6.I3(6) U8.K4(13)
Pin_4_placa_Entrada: P4.4 P6.4 R40.1
Pin_5_pernos: R41.2 U7.I4(5) U9.K5(12)
Pin_5_pernos_Entrada: P5.5 P8.5 R41.1
Pin_5_placa: R42.2 U6.I4(5) U8.K5(12)
Pin_5_placa_Entrada: P4.5 P6.5 R42.1
Pin_6_pernos: R39.2 U7.I5(4) U9.K6(11)
Pin_6_pernos_Entrada: P5.6 P8.6 R39.1
Pin_6_placa: R44.2 U6.I5(4) U8.K6(11)
Pin_6_placa_Entrada: P4.6 P6.6 R44.1
Pin_7_pernos: R37.2 U7.I6(3) U9.K7(10)
Pin_7_pernos_Entrada: P5.7 P8.7 R37.1
Pin_7_placa: R46.2 U6.I6(3) U8.K7(10)
Pin_7_placa_Entrada: P4.7 P6.7 R46.1
Pin_8_pernos: R35.2 U7.I7(2) U9.K8(9)
Pin_8_pernos_Entrada: P8.8 R35.1
Pin_8_placa: R48.2 U6.I7(2) U8.K8(9)
Pin_8_placa_Entrada: P6.8 R48.1
Pin_9_pernos: R65.1 U7.I8(23) U11.K1(16)
Pin_9_pernos_Entrada: P9.1 R65.2
Pin_9_placa: R64.1 U6.I8(23) U10.K1(16)
Pin_9_placa_Entrada: P7.1 R64.2
Pin_10_pernos: R63.1 U7.I9(22) U11.K2(15)
Pin_10_pernos_Entrada: P9.2 R63.2
Pin_10_placa: R62.1 U6.I9(22) U10.K2(15)
Pin_10_placa_Entrada: P7.2 R62.2
Pin_11_pernos: R61.1 U7.I10(21) U11.K3(14)
Pin_11_pernos_Entrada: P9.3 R61.2
Pin_11_placa: R60.1 U6.I10(21) U10.K3(14)
Pin_11_placa_Entrada: P7.3 R60.2
Pin_12_pernos: R59.1 U7.I11(20) U11.K4(13)
Pin_12_pernos_Entrada: P9.4 R59.2
Pin_12_placa: R58.1 U6.I11(20) U10.K4(13)
Pin_12_placa_Entrada: P7.4 R58.2
Pin_13_pernos: R57.1 U7.I12(19) U11.K5(12)
Pin_13_pernos_Entrada: P9.5 R57.2
Pin_13_placa: R56.1 U6.I12(19) U10.K5(12)
Pin_13_placa_Entrada: P7.5 R56.2
Pin_14_pernos: R55.1 U7.I13(18) U11.K6(11)
Pin_14_pernos_Entrada: P9.6 R55.2
Pin_14_placa: R54.1 U6.I13(18) U10.K6(11)
Pin_14_placa_Entrada: P7.6 R54.2
Pin_15_pernos: R53.1 U7.I14(17) U11.K7(10)
Pin_15_pernos_Entrada: P9.7 R53.2
Pin_15_placa: R52.1 U6.I14(17) U10.K7(10)
Pin_15_placa_Entrada: P7.7 R52.2
Pin_16_pernos: R51.1 U7.I15(16) U11.K8(9)
Pin_16_pernos_Entrada: P9.8 R51.2
Pin_16_placa: R50.1 U6.I15(16) U10.K8(9)
Pin_16_placa_Entrada: P7.8 R50.2
Pul_1: C5.2 Pul1.1 R28.2
Pul_2: C6.2 Pul2.1 R29.2
Pul_3: C7.2 Pul3.1 R31.2
Pul_4: C8.2 Pul4.1 R32.2
S0_pernos: U7.S0(10)
S0_placa: U6.S0(10)
S1_pernos: U7.S1(11)
S1_placa: U6.S1(11)
S2_pernos: U7.S2(14)
S2_placa: U6.S2(14)
S3_pernos: U7.S3(13)
S3_placa: U6.S3(13)
VCC_Leds_Manillar: P10.4
NetC9_2: C9.2 J3.3(VCC) J4.1 J5.1 Q10.3(VCC) R30.1 R66.1
NetJ3_2: J3.2(Data) J4.2 J5.2 Q10.2(Data) R66.2 R67.2
NetR23_2: R23.2 U6.In-Out(1)
NetR24_1: R24.1 R70.1 U7.In-Out(1)

### Library data of the parts
C5-C8 = Cap: as C2 on sheet Microcontrolador; PackageReference: 6-0805_M; PackageDescription: Radial Cap, Thru-Hole; 2 Leads; 0.3 in Pin Spacing; Value: 100nF; Cod.Digikey: 399-1170-1-ND; DIGIKEYx100: 0.08340
C9 = C_0805_3D: CAP CER 0.1UF 25V X7R 0805; Fabricante: KEMET; Cod.Fabricante: C0805C104K3RACTU; Note: Footprint corresponds to dimensions for bulk cassette packaging. This case size has tightened tolerances.; Px100: 0.02540; Published: 17-Jul-2002; LatestRevisionDate: 19-Mar-2004; LatestRevisionNote: Silkscreen size reduced.; PackageReference: 0805; Publisher: Altium Limited; Value: 0.1uF; Cod.Digikey: 399-1168-1-ND; DatasheetDocument: Mar-2001; PackageDocument: Mar-2001; Code_JEITA: 0805; Code_IPC: 2012[0805]; ComponentLink1Description: Manufacturer Link; ComponentLink1URL: http://www.kemet.com/; ComponentLink2Description: Datasheet; ComponentLink2URL: http://www.kemet.com/kemet/web/homepage/kechome.nsf/vapubfilesname/F3102TA.pdf/$file/F3102TA.pdf; DIGIKEYx100: 0.02540
C10 = C_0805_3D: CAP CER 100PF 25V X7R 0805; Fabricante: KEMET; Cod.Fabricante: C0805C101K3RAC7800; Published: 17-Jul-2002; LatestRevisionDate: 19-Mar-2004; LatestRevisionNote: Silkscreen size reduced.; PackageReference: 0805; Publisher: Altium Limited; Value: 100p; Cod.Digikey: 399-15002-1-ND; DatasheetDocument: Mar-2001; PackageDocument: Mar-2001; Code_JEITA: 0805; Code_IPC: 2012[0805]; ComponentLink1Description: Manufacturer Link; ComponentLink1URL: http://www.kemet.com/; ComponentLink2Description: Datasheet; ComponentLink2URL: http://www.kemet.com/kemet/web/homepage/kechome.nsf/vapubfilesname/F3102TA.pdf/$file/F3102TA.pdf; DIGIKEYx100: 0.12340
J3 = DS18S20-ZocaloDirecto: CONN HDR 3POS 0.1 GOLD PCB; Cod.Fabricante: PPPC031LFBN-RC; Fabricante: Sullins Connector Solutions; Cod.DigiKey: S7036-ND; ComponentLink1Description: Manufacturer Link; ComponentLink1URL: https://drawings-pdf.s3.amazonaws.com/10492.pdf; ComponentLink2Description: Datasheet; ComponentLink2URL: https://media.digikey.com/pdf/Data%20Sheets/Sullins%20PDFs/Female_Headers.100_DS.pdf; DatasheetVersion: *; DIGIKEYx10: 0.26910; LatestRevisionDate: *; LatestRevisionNote: *; PackageDescription: *; PackageReference: *; PackageVersion: *; Published: 29-sep-00; Publisher: Altium Limited; Value: *
J4 J5 = JST_2.5_3_1: as P1 on sheet Microcontrolador; LatestRevisionDate: 17-Jul-2002; LatestRevisionNote: Re-released for DXP Platform.; Publisher: Altium Limited; Cod.Digikey: 455-2248-ND; ComponentLink2Description: Datasheet; ComponentLink2URL: http://www.jst-mfg.com/product/pdf/eng/eXH.pdf; DIGIKEYx100: 0.1115
P4 = JST_2.5_7: CONN HEADER XH TOP 7POS 2.5MM; Cod.Fabricante: B7B-XH-A(LF)(SN); Fabricante: JST Sales America Inc.; Funcion: Pines para los pernos; LatestRevisionDate: 17-Jul-2002; LatestRevisionNote: Re-released for DXP Platform.; Publisher: Altium Limited; Cod.Digikey: 455-2252-ND; ComponentLink2Description: Datasheet; ComponentLink2URL: http://www.jst-mfg.com/product/pdf/eng/eXH.pdf; DIGIKEYx100: 0.2156
P5 = JST_2.5_7: CONN HEADER XH TOP 7POS 2.5MM; Cod.Fabricante: B7B-XH-A(LF)(SN); Fabricante: JST Sales America Inc.; LatestRevisionDate: 17-Jul-2002; LatestRevisionNote: Re-released for DXP Platform.; Publisher: Altium Limited; Cod.Digikey: 455-2252-ND; ComponentLink2Description: Datasheet; ComponentLink2URL: http://www.jst-mfg.com/product/pdf/eng/eXH.pdf; DIGIKEYx100: 0.2156; Funcion: Pines para los pernos
P6-P9 = PinesMacho8: Connector Header Through Hole 8 position 0.100" (2.54mm); Cod.Fabricante: 61300811121; Fabricante: Wurth Electronics Inc.; Cod.DigiKey: 732-5321-ND; ComponentLink1Description: Manufacturer Link; ComponentLink1URL: https://katalog.we-online.de/em/datasheet/6130xx11121.pdf; ComponentLink2Description: Datasheet; ComponentLink2URL: *; DatasheetVersion: *; DIGIKEYx100: 0.19900; LatestRevisionDate: *; LatestRevisionNote: *; PackageDescription: *; PackageReference: *; PackageVersion: *; Published: 29-sep-00; Publisher: Altium Limited; Value: *
P10 = JST_2.5_4: as M3 on sheet Microcontrolador; LatestRevisionDate: 17-Jul-2002; LatestRevisionNote: Re-released for DXP Platform.; Publisher: Altium Limited; Cod.Digikey: 455-2249-ND; ComponentLink2Description: Datasheet; ComponentLink2URL: http://www.jst-mfg.com/product/pdf/eng/eXH.pdf; DIGIKEYx100: 0.1348
Pul1-Pul4 = Jumper-Simple: CONN HEADER 2 POS 2.54; Cod.Fabricante: 61300211121; Fabricante: Wurth Electronics Inc.; Cod.DigiKey: 732-5315-ND; ComponentLink1Description: Manufacturer Link; ComponentLink1URL: https://katalog.we-online.de/em/datasheet/6130xx11121.pdf; ComponentLink2Description: Datasheet; ComponentLink2URL: *; DatasheetVersion: *; DIGIKEYx100: 0.06700; LatestRevisionDate: *; LatestRevisionNote: *; PackageDescription: *; PackageReference: *; PackageVersion: *; Published: 29-sep-00; Publisher: Altium Limited; Value: Jumper-Simple
Q10 = DS18S20-Soldado: Temperature Sensor Digital, Local -55°C ~ 125°C 8 b TO-92-3; Cod.Fabricante: DS18S20+; Fabricante: Maxim Integrated; Cod.DigiKey: DS18S20+-ND; ComponentLink1Description: Manufacturer Link; ComponentLink1URL: https://datasheets.maximintegrated.com/en/ds/DS18S20.pdf; ComponentLink2Description: Datasheet; ComponentLink2URL: *; DatasheetVersion: *; DIGIKEYx10: 2.96300; LatestRevisionDate: *; LatestRevisionNote: *; PackageDescription: *; PackageReference: TO92; PackageVersion: *; Published: 29-sep-00; Publisher: Altium Limited; Value: DS18S20
R23 R34-R65 = Res3: as R7 on sheet Microcontrolador; PackageReference: 6-0805_M; PackageDescription: Chip Resistor; Value: 1k; Cod.Digikey: 311-1.00KCRCT-ND; ComponentLink1Description: Manufacturer Link; ComponentLink1URL: http://www.yageo.com/documents/recent/PYu-RC_Group_51_RoHS_L_10.pdf; ComponentLink2Description: Datasheet; ComponentLink2URL: http://www.yageo.com/exep/pages/download/literatures/PYu-R_Marking_2.pdf; DatasheetVersion: 1996; DIGIKEYx100: 0.017; LatestRevisionDate: 17-jul-02; LatestRevisionNote: Re-released for DXP Platform.; PackageVersion: *; Published: *; Publisher: *
R24 R28 R29 R31 R32 = Res3: as R3 on sheet Microcontrolador; PackageReference: 6-0805_M; PackageDescription: Chip Resistor; Value: 10k; Cod.Digikey: 311-10.0KCRCT-ND; ComponentLink1Description: Manufacturer Link; ComponentLink1URL: http://www.yageo.com/documents/recent/PYu-RC_Group_51_RoHS_L_10.pdf; ComponentLink2Description: Datasheet; ComponentLink2URL: http://www.yageo.com/exep/pages/download/literatures/PYu-R_Marking_2.pdf; DatasheetVersion: 1996; DIGIKEYx100: 0.017; LatestRevisionDate: 17-jul-02; LatestRevisionNote: Re-released for DXP Platform.; PackageVersion: *; Published: *; Publisher: *
R30 R67 R70 = R_0805_3D: RES SMD 100 OHM 1% 1/8W 0805; Cod.Fabricante: RC0805FR-07100RL; Fabricante: Yageo; Published: 8-Jun-2000; LatestRevisionDate: 17-Jul-2002; LatestRevisionNote: Re-released for DXP Platform.; PackageReference: 0805; Publisher: Altium Limited; PackageDescription: 0805; Cod.Digikey: 311-100CRCT-ND; Value: 100; DIGIKEYx100: 0.0088
R33 = Res3: RES SMD 27 OHM 1% 1/8W 0805; Cod.Fabricante: RC0805FR-0727RL; Fabricante: Yageo; PackageReference: 6-0805_M; PackageDescription: Chip Resistor; Value: 27; Cod.Digikey: 311-27.0CRCT-ND; ComponentLink1Description: Manufacturer Link; ComponentLink1URL: http://www.yageo.com/documents/recent/PYu-RC_Group_51_RoHS_L_10.pdf; ComponentLink2Description: Datasheet; ComponentLink2URL: http://www.yageo.com/exep/pages/download/literatures/PYu-R_Marking_2.pdf; DatasheetVersion: 1996; DIGIKEYx100: 0.017; LatestRevisionDate: 17-jul-02; LatestRevisionNote: Re-released for DXP Platform.; PackageVersion: *; Published: *; Publisher: *
R66 = R_0805_3D: RES SMD 1K OHM 1% 1/8W 0805; Cod.Fabricante: RC0805FR-071KL; Fabricante: Yageo; Published: 8-Jun-2000; LatestRevisionDate: 17-Jul-2002; LatestRevisionNote: Re-released for DXP Platform.; PackageReference: 0805; Publisher: Altium Limited; PackageDescription: 0805; Cod.Digikey: 311-1.00KCRCT-ND; Value: 1K; DIGIKEYx100: 0.0088
TP10-TP13 = TestPoint: as TP1 on sheet Microcontrolador; Cod.DigiKey: 36-5002-ND; ComponentLink1Description: Manufacturer Link; ComponentLink1URL: http://www.keyelco.com/product-pdf.cfm?p=1311; ComponentLink2Description: Datasheet; ComponentLink2URL: *; DatasheetVersion: *; DIGIKEYx100: 0.22090; LatestRevisionDate: *; LatestRevisionNote: *; PackageDescription: *; PackageReference: *; PackageVersion: *; Published: 29-sep-00; Publisher: Altium Limited; Value: Test point
U6 U7 = CD74HC4067M96: IC MUX/DEMUX 1X16 24SOIC; Fabricante: Texas Instruments; Cod.DigiKey: 296-29408-1-ND; Cod.Fabricante: CD74HC4067M96; ComponentLink1Description: http://www.ti.com/lit/ds/symlink/cd74hc4067.pdf; ComponentLink1URL: http://www.ti.com/lit/ds/symlink/cd74hc4067.pdf; DatasheetVersion: *; DIGIKEYx100: 0.53940; PackageReference: SOIC24; Value: CD74HC4067M96
U8-U11 = S1605-8TR: 9.8V Clamp 1A Ipp Tvs Diode Surface Mount 16-SO; Fabricante: SMC Diode Solutions; Cod.DigiKey: 1655-2148-1-ND; Cod.Fabricante: S1605-8TR; ComponentLink1Description: http://www.smc-diodes.com/propdf/S1603-8%20THRU%20S1624-8%20N0293%20REV.A.pdf; ComponentLink1URL: https://www.digikey.com/catalog/en/partgroup/s16xx-8-series/62484?mpart=S1605-8TR&vendor=1655; DatasheetVersion: *; DIGIKEYx100: 0.68070; PackageReference: SO16; Value: S1605-8TR

## Nets that join several sheets
+5: Microcontrolador (15 pins), ProbadorManillaresCrio (9 pins)
GND: Microcontrolador (37 pins), ProbadorManillaresCrio (54 pins)
ADC_Leds: Microcontrolador (U1.23), ProbadorManillaresCrio (P10.1 R33.1)
DatosTemperatura: Microcontrolador (U1.9), ProbadorManillaresCrio (P10.2 R67.1)
E_pernos: Microcontrolador (U1.22), ProbadorManillaresCrio (U7.E-Neg)
E_placa: Microcontrolador (U1.25), ProbadorManillaresCrio (U6.E-Neg)
Pernos_Continuidad: Microcontrolador (U1.24), ProbadorManillaresCrio (C10.1 R70.2)
Pul_1: Microcontrolador (U1.14), ProbadorManillaresCrio (C5.2 Pul1.1 R28.2)
Pul_2: Microcontrolador (U1.12), ProbadorManillaresCrio (C6.2 Pul2.1 R29.2)
Pul_3: Microcontrolador (U1.15), ProbadorManillaresCrio (C7.2 Pul3.1 R31.2)
Pul_4: Microcontrolador (M1.3 TP1.1 U1.13), ProbadorManillaresCrio (C8.2 Pul4.1 R32.2)
S0_pernos: Microcontrolador (U1.18), ProbadorManillaresCrio (U7.S0)
S0_placa: Microcontrolador (U1.28), ProbadorManillaresCrio (U6.S0)
S1_pernos: Microcontrolador (U1.19), ProbadorManillaresCrio (U7.S1)
S1_placa: Microcontrolador (U1.31), ProbadorManillaresCrio (U6.S1)
S2_pernos: Microcontrolador (U1.21), ProbadorManillaresCrio (U7.S2)
S2_placa: Microcontrolador (U1.26), ProbadorManillaresCrio (U6.S2)
S3_pernos: Microcontrolador (U1.20), ProbadorManillaresCrio (U7.S3)
S3_placa: Microcontrolador (U1.27), ProbadorManillaresCrio (U6.S3)
VCC_Leds_Manillar: Microcontrolador (Q8.3), ProbadorManillaresCrio (P10.4)